# EAGLE design board02 (EAGLE 6.5.0)
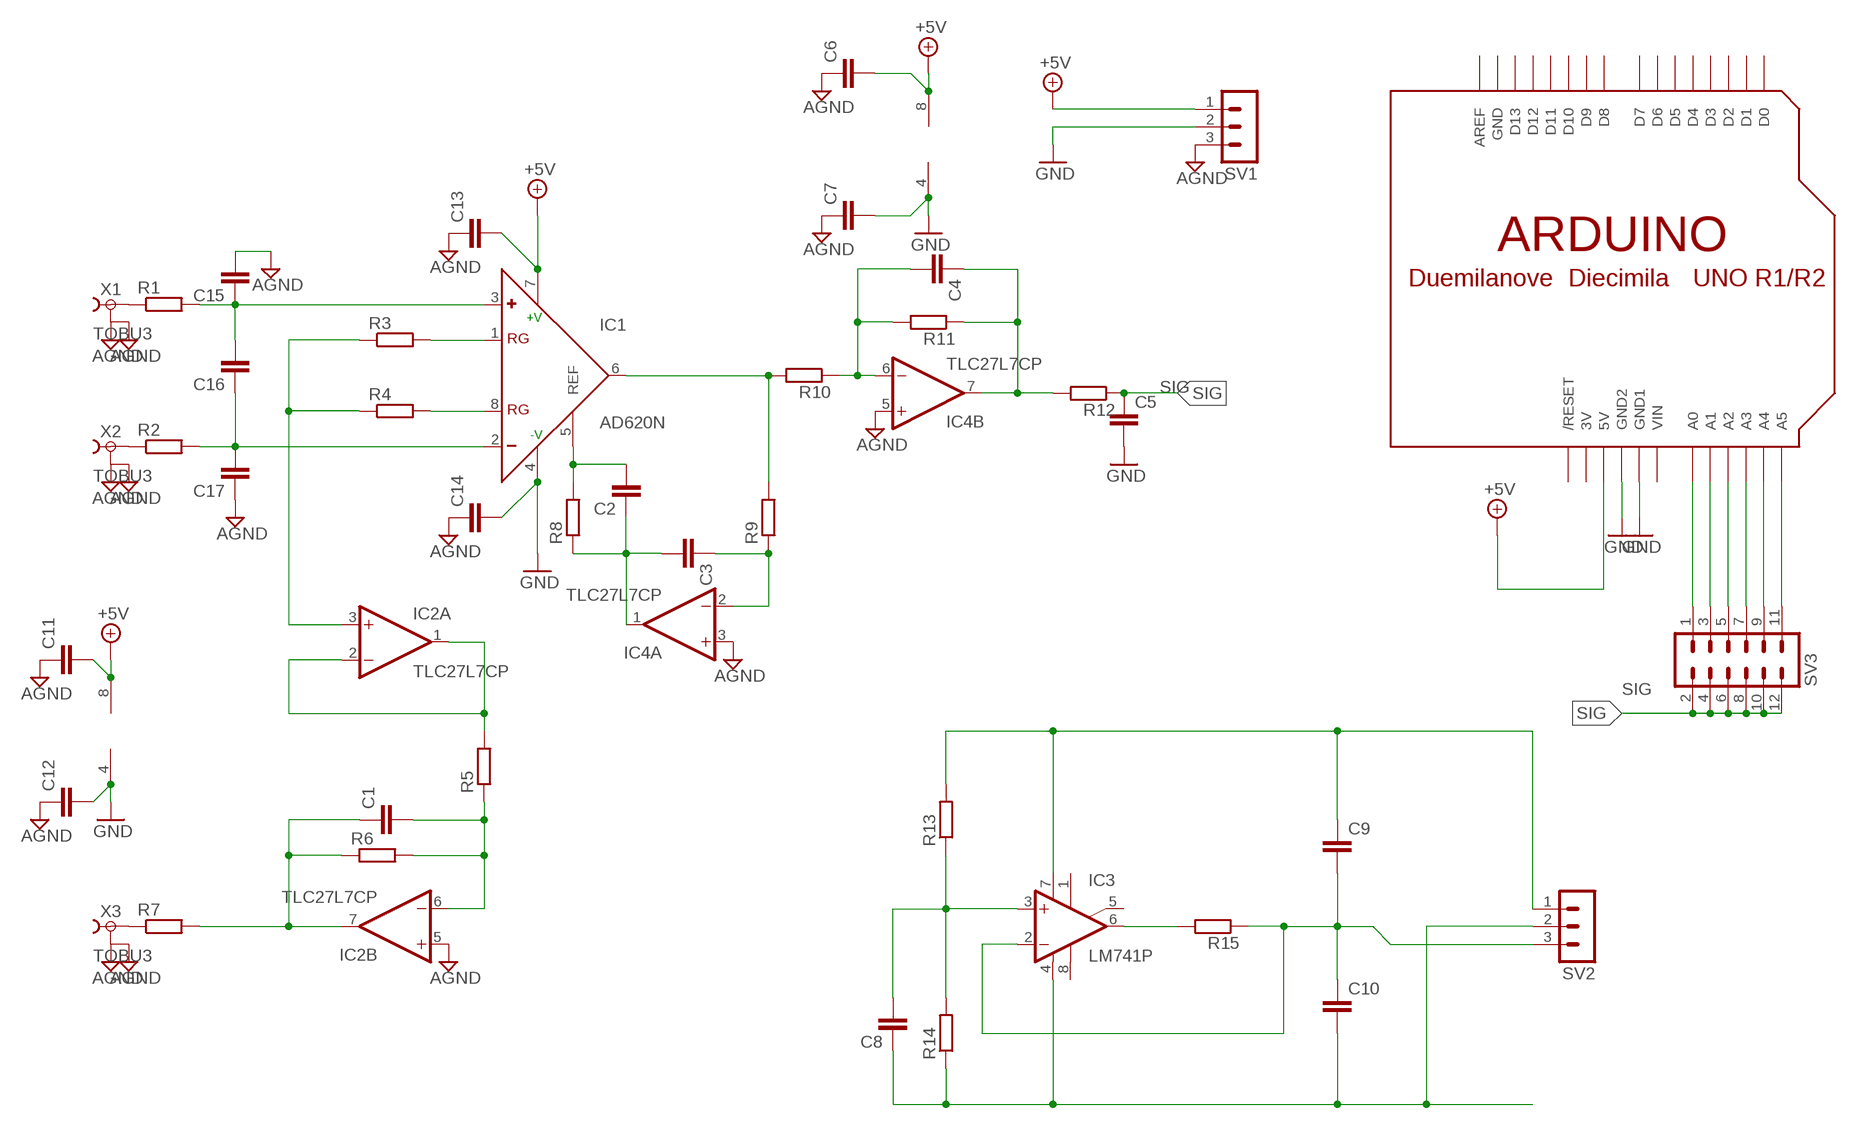
[diagram p0: schematic, sheet 1]

## Parts
C1  C-EU050-050X075  [C050-050X075]
C2  C-EU050-050X075  [C050-050X075]
C3  C-EU050-050X075  [C050-050X075]
C4  C-EU050-050X075  [C050-050X075]
C5  C-EU050-025X075  [C050-025X075]
C6  C-EU050-025X075  [C050-025X075]
C7  C-EU050-025X075  [C050-025X075]
C8  C-EU050-025X075  [C050-025X075]
C9  C-EU050-025X075  [C050-025X075]
C10  C-EU050-025X075  [C050-025X075]
C11  C-EU050-025X075  [C050-025X075]
C12  C-EU050-025X075  [C050-025X075]
C13  C-EU050-025X075  [C050-025X075]
C14  C-EU050-025X075  [C050-025X075]
C15  C-EU050-025X075  [C050-025X075]
C16  C-EU050-025X075  [C050-025X075]
C17  C-EU050-025X075  [C050-025X075]
IC1  AD620N  [DIL08]
IC2  TLC27L7CP  [DIL08]
IC3  LM741P  [DIL08]
IC4  TLC27L7CP  [DIL08]
R1  R-EU_0204/7  [0204/7]
R2  R-EU_0204/7  [0204/7]
R3  R-EU_0204/7  [0204/7]
R4  R-EU_0204/7  [0204/7]
R5  R-EU_0204/7  [0204/7]
R6  R-EU_0204/7  [0204/7]
R7  R-EU_0204/7  [0204/7]
R8  R-EU_0204/7  [0204/7]
R9  R-EU_0204/7  [0204/7]
R10  R-EU_0204/7  [0204/7]
R11  R-EU_0204/7  [0204/7]
R12  R-EU_0204/7  [0204/7]
R13  R-EU_0204/7  [0204/7]
R14  R-EU_0204/7  [0204/7]
R15  R-EU_0204/7  [0204/7]
SV1  MA03-1  [MA03-1]
SV2  MA03-1  [MA03-1]
SV3  MA06-2  [MA06-2]
U$2  ARDUINO-NC  [ARDUINO-NOCONN]
X1  TOBU3  [TOBU3]
X2  TOBU3  [TOBU3]
X3  TOBU3  [TOBU3]

## Nets
+5V: C6.2 C11.2 C13.2 IC1.7(+V) IC2.8(C:VDD) IC4.8(C:VDD) SV1.1 U$2.5V
AGND: C6.1 C7.1 C11.1 C12.1 C13.1 C14.1 C15.2 C17.1 IC2.5(B:+IN) IC4.3(A:+IN) IC4.5(B:+IN) SV1.3 X1.2 X1.2@1 X1.2@2 X2.2 X2.2@1 X2.2@2 X3.2 X3.2@1 X3.2@2
GND: C5.2 C7.2 C12.2 C14.2 IC1.4(-V) IC2.4(C:GND) IC4.4(C:GND) SV1.2 U$2.GND1 U$2.GND2
N$1: C15.1 C16.2 IC1.3(+) R1.2
N$2: C16.1 C17.2 IC1.2(-) R2.2
N$3: IC1.1(RG) R3.2
N$4: IC1.8(RG) R4.2
N$5: C1.1 IC2.7(B:OUT) R6.1 R7.2
N$6: IC2.3(A:+IN) R3.1 R4.1
N$7: IC2.1(A:OUT) IC2.2(A:-IN) R5.2
N$8: C1.2 IC2.6(B:-IN) R5.1 R6.2
N$9: C2.1 C3.2 IC4.1(A:OUT) R8.1
N$10: C2.2 IC1.5(REF) R8.2
N$11: IC1.6(OUT) R9.2 R10.2
N$12: C3.1 IC4.2(A:-IN) R9.1
N$13: C4.2 IC4.6(B:-IN) R10.1 R11.2
N$14: C4.1 IC4.7(B:OUT) R11.1 R12.2
N$16: R1.1 X1.1
N$17: R2.1 X2.1
N$18: R7.1 X3.1
N$19: C8.1 C10.2 IC3.4(V-) R14.1 SV2.2
N$20: C8.2 IC3.3(+IN) R13.1 R14.2
N$21: C9.1 IC3.7(V+) R13.2 SV2.1
N$22: IC3.6(OUT) R15.2
N$23: C9.2 C10.1 IC3.2(-IN) R15.1 SV2.3
N$24: SV3.1 U$2.A0
N$25: SV3.3 U$2.A1
N$26: SV3.5 U$2.A2
N$27: SV3.7 U$2.A3
N$28: SV3.9 U$2.A4
N$29: SV3.11 U$2.A5
SIG: C5.1 R12.1 SV3.2 SV3.4 SV3.6 SV3.8 SV3.10 SV3.12
Unconnected: IC3.1(ON1) IC3.5(ON2) IC3.8(OPT) U$2.AREF U$2.D0 U$2.D1 U$2.D2 U$2.D3 U$2.D4 U$2.D5 U$2.D6 U$2.D7 U$2.D8 U$2.D9 U$2.D10 U$2.D11 U$2.D12 U$2.D13 U$2.RESET(/RESET)

## Power pins joined to a net without a drawn wire
3V: U$2.3V
GND: U$2.GND
VIN: U$2.VIN

## Library data of the parts
C1-C17 = rcl:C-EU: CAPACITOR, European symbol
IC1 = analog-devices:AD620: Low Cost, Low Power, Instrumentation Amplifier Source: http://www.analog.com/UploadedFiles/Data_Sheets/37793330023930AD620_e.pdf; MF: ALTERA CORPORATION; MPN: AD620AN; OC_FARNELL: 1523782; OC_NEWARK: 05F7108
IC2 IC4 = linear:TLC27L*: LinCMOS(TM) PRECISION DUAL OPERATIONAL AMPLIFIERS Source: http://focus.ti.com/lit/ds/symlink/tlc27l2.pdf
IC3 = linear:*741: OP AMP
R1-R15 = rcl:R-EU_: RESISTOR, European symbol
SV1 SV2 = con-lstb:MA03-1: PIN HEADER; OC_FARNELL: unknown; OC_NEWARK: unknown
SV3 = con-lstb:MA06-2: PIN HEADER; OC_FARNELL: unknown; OC_NEWARK: unknown
U$2 = adafruit:ARDUINO: Arduino Diecimila/Duemilanove Make a shield with ease, this package has all the named pins as well as the two mounting drill holes and an outline of the USB and DC power connector. The outline is on the DIMENSION layer, so if your board house uses it they will cut the outline to match. http://www.ladyada.net/library/pcb/eaglelibrary.html
X1-X3 = con-hirschmann:TOBU3: Female Cinch CONNECTOR ( RCA Jack ); MF: FARNELL; MPN: TOBU 3; OC_FARNELL: 592791; OC_NEWARK: 06WX5914

## Board
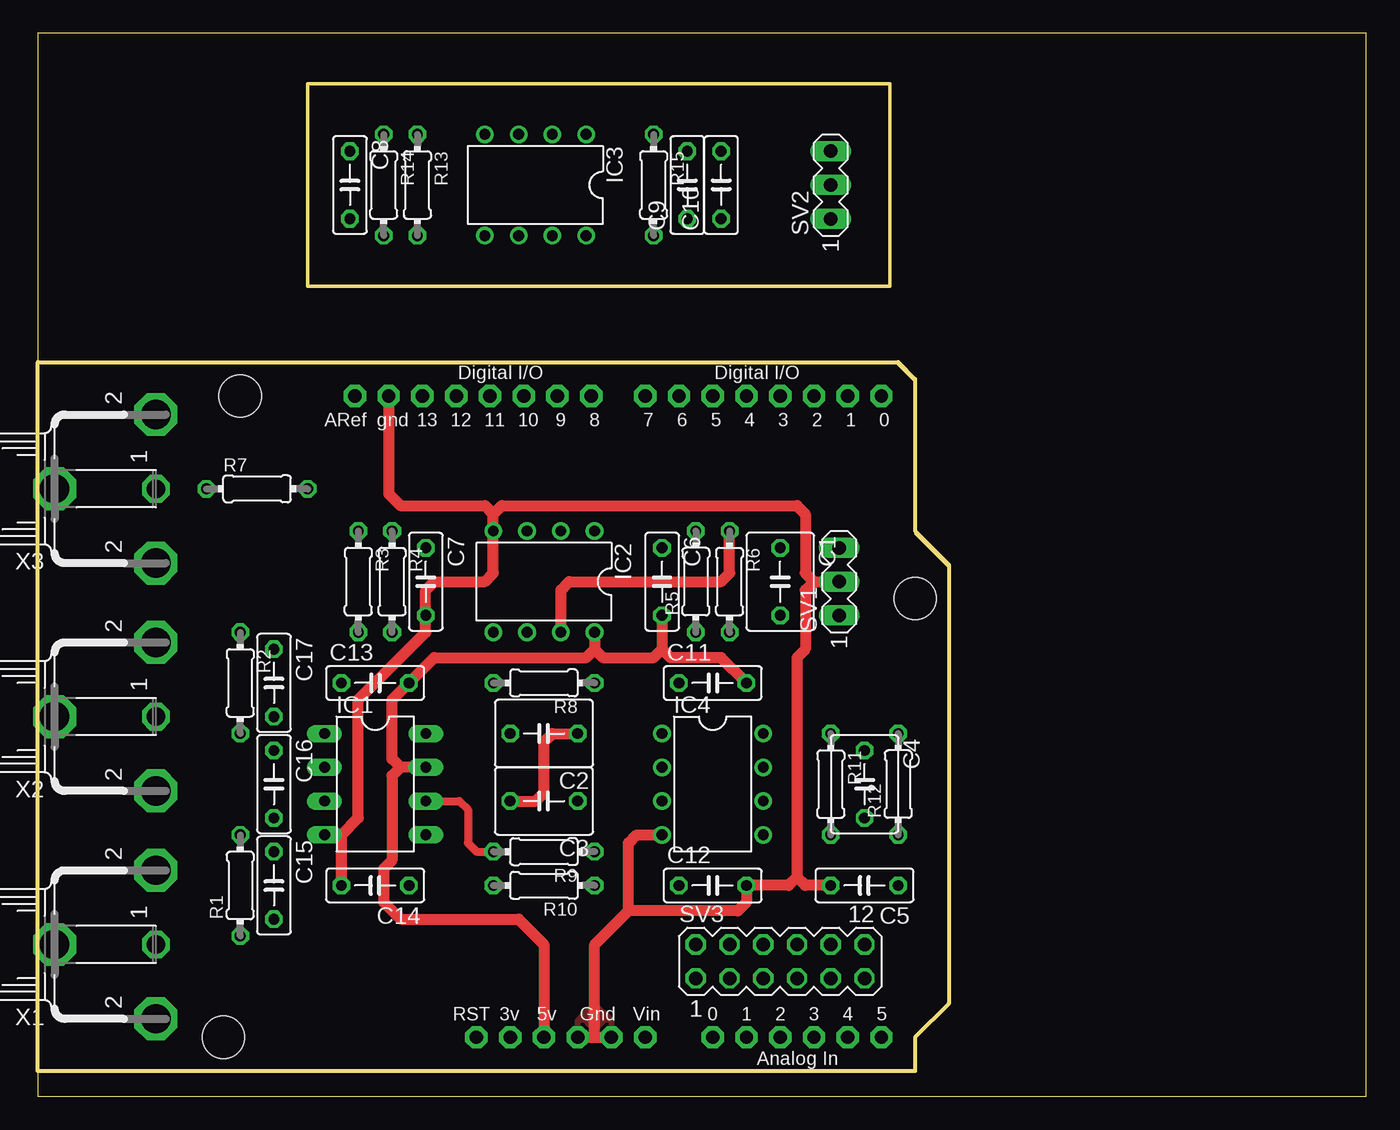
[diagram p1: board, top side]
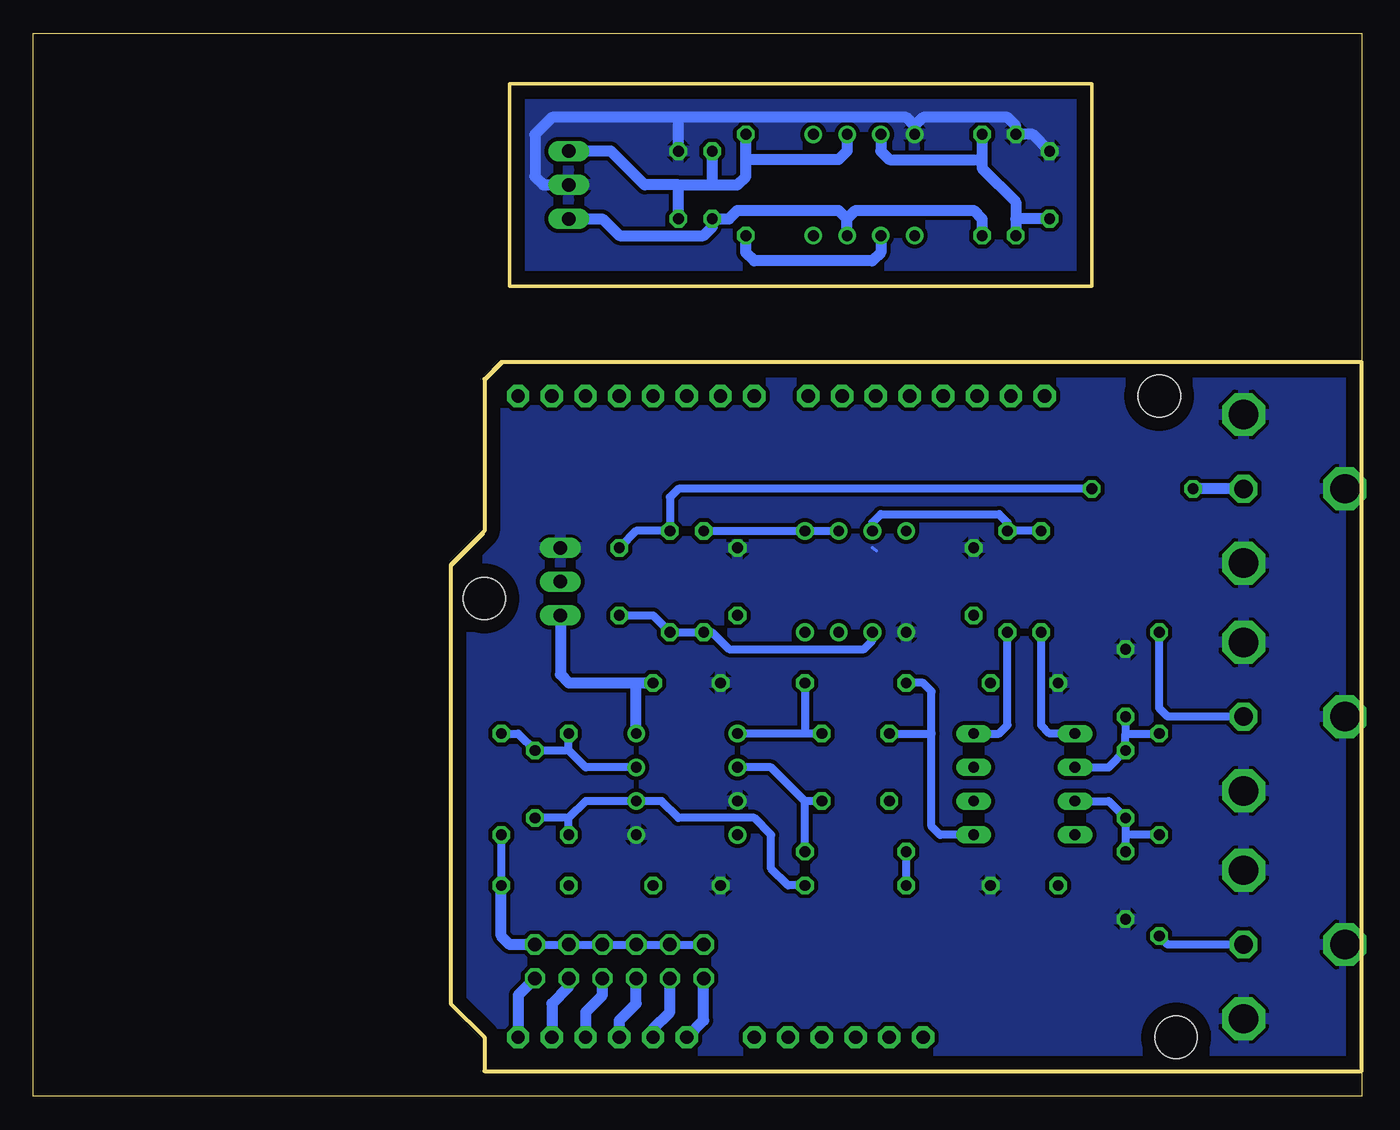
[diagram p2: board, bottom side, seen from below]

Size 100 x 80 mm. Coordinates in mm from the lower left corner, seen from the top.
Outline: 0,55.24 0,80 100,80 100,0 0,0 0,1.91
Outline: 0,55.24 64.77,55.24 66.04,53.98 66.04,42.55 68.58,40.01 68.58,6.99 66.04,4.45 66.04,1.91 0,1.91
Outline: 0,1.91 0,55.24
Outline: 64.14,76.2 64.14,60.96 20.32,60.96 20.32,76.2 64.14,76.2
Copper layers (1*16): Top 0.035mm / dielectric 1.5mm / Bottom 0.035mm
Design rules "default": minimum track width 10mil, minimum drill 24mil, track to track 8mil, track to pad 8mil, pad to pad 8mil, via to via 8mil, smd to smd 8mil, copper to edge 40mil, drill to drill 8mil, minimum pad ring 10mil, minimum via ring 8mil, stop-mask expansion 4mil, vias tented up to drill 0mil, thermal gap 10mil

### Footprints (pad centres in the part's own frame; a part is rotated, then mirrored left to right if it is on the bottom)
C050-050X075 = drill 0.813 octagon: 1 -2.54,0; 2 2.54,0
C050-025X075 = drill 0.813 octagon: 1 -2.54,0; 2 2.54,0
DIL08 = drill 0.813 long: 1 -3.81,-3.81; 2 -1.27,-3.81; 3 1.27,-3.81; 4 3.81,-3.81; 5 3.81,3.81; 6 1.27,3.81; 7 -1.27,3.81; 8 -3.81,3.81
DIL08' = drill 0.813 pad 1.27: 1 -3.81,-3.81; 2 -1.27,-3.81; 3 1.27,-3.81; 4 3.81,-3.81; 5 3.81,3.81; 6 1.27,3.81; 7 -1.27,3.81; 8 -3.81,3.81
0204/7 = drill 0.813 octagon: 1 -3.81,0; 2 3.81,0
MA03-1 = drill 1.016 long: 1 -2.54,0; 2 0,0; 3 2.54,0
MA06-2 = drill 1.016 octagon: 1 -6.35,-1.27; 2 -6.35,1.27; 3 -3.81,-1.27; 4 -3.81,1.27; 5 -1.27,-1.27; 6 -1.27,1.27; 7 1.27,-1.27; 8 1.27,1.27; 9 3.81,-1.27; 10 3.81,1.27; 11 6.35,-1.27; 12 6.35,1.27
ARDUINO-NOCONN = drill 1 pad 1.676 octagon: 3V 35.56,2.54; 5V 38.1,2.54; A0 50.8,2.54; A1 53.34,2.54; A2 55.88,2.54; A3 58.42,2.54; A4 60.96,2.54; A5 63.5,2.54; AREF 23.876,50.8; D0 63.5,50.8; D1 60.96,50.8; D2 58.42,50.8; D3 55.88,50.8; D4 53.34,50.8; D5 50.8,50.8; D6 48.26,50.8; D7 45.72,50.8; D8 41.656,50.8; D9 39.116,50.8; D10 36.576,50.8; D11 34.036,50.8; D12 31.496,50.8; D13 28.956,50.8; GND 26.416,50.8; GND1 43.18,2.54; GND2 40.64,2.54; RESET 33.02,2.54; VIN 45.72,2.54 | hole 3.2: 15.24,50.8; 66.04,35.56; 13.97,2.54
TOBU3 = drill 1.397 octagon: 1 0,-2.54 | drill 2.21 octagon: 2 5.588,-2.54; 2@1 -5.588,-2.54; 2@2 0,5.08

### Placement (x,y rotation side)
C1  55.88,38.73 270 top
C2  38.1,27.3 180 top
C3  38.1,22.23 180 top
C4  62.23,23.5 270 top
C5  62.23,15.88 180 top
C6  46.99,38.73 270 top
C7  29.21,38.73 270 top
C8  23.5,68.58 270 top
C9  48.9,68.58 90 top
C10  51.44,68.58 90 top
C11  50.8,31.11 0 top
C12  50.8,15.88 0 top
C13  25.4,31.11 0 top
C14  25.4,15.88 180 top
C15  17.78,15.88 270 top
C16  17.78,23.5 270 top
C17  17.78,31.11 270 top
IC1  25.4,23.5 270 top
IC2  TLC27L7CP  [DIL08']  38.1,38.73 180 top
IC3  LM741P  [DIL08']  37.47,68.58 180 top
IC4  TLC27L7CP  [DIL08']  50.8,23.5 270 top
R1  15.24,15.88 90 top
R2  15.24,31.11 270 top
R3  24.13,38.73 270 top
R4  26.67,38.73 270 top
R5  49.53,38.73 90 top
R6  52.07,38.73 270 top
R7  16.51,45.72 0 top
R8  38.1,31.11 180 top
R9  38.1,18.41 180 top
R10  38.1,15.88 180 top
R11  59.69,23.5 270 top
R12  64.77,23.5 90 top
R13  28.57,68.58 270 top
R14  26.04,68.58 270 top
R15  46.35,68.58 270 top
SV1  60.33,38.73 90 top
SV2  59.69,68.58 90 top
SV3  55.88,10.16 0 top
U$2  0,1.91 0 top
X1  6.35,11.43 90 top
X2  6.35,28.57 90 top
X3  6.35,45.72 90 top

### Tracks (layer width: path | path; a pad name or v marks a point on that pad's centre or on a via)
+5V
  Top 0.813: C11.2 51.44,33.02 47.62,33.02 46.99,33.66 | 41.91,33.66 41.27,33.02 29.84,33.02 C13.2 26.67,29.84 26.67,25.4 27.3,24.77 | IC2.8 41.91,33.66 | 41.91,33.66 42.55,33.02 46.35,33.02 46.99,33.66 | C6.2 46.99,33.66 | IC1.7 27.3,24.77 | 27.3,24.77 26.67,24.13 26.67,17.78 26.04,17.14 26.04,14.61 27.3,13.34 36.2,13.34 38.1,11.43 U$2.5V
  Bottom 0.813: SV1.1 60.33,31.75 59.69,31.11 54.61,31.11 | 54.61,31.11 C11.2 | IC4.8 54.61,31.11
AGND
  Bottom 0.254: 36.83,41.27 36.54,41.07 | X3.2 8.89,51.44 8.74,51.16 | IC4.3
  pour Bottom (isolate 0.305, rank 2): 0,55.24 64.14,55.24 66.04,53.34 66.04,42.55 69.22,39.37 68.58,6.99 66.04,4.45 66.04,1.91 0,1.91
GND
  Top 0.813: C14.2 22.86,19.68 | IC1.4 22.86,19.68 | 22.86,19.68 24.13,20.95 24.13,29.84 29.21,34.92 C7.2 29.21,38.1 29.84,38.73 33.66,38.73 34.29,39.37 IC2.4 34.29,43.81 | 58.42,38.73 57.78,38.1 57.78,33.66 57.15,33.02 57.15,16.51 | 34.29,43.81 34.92,44.45 57.15,44.45 57.78,43.81 57.78,39.37 58.42,38.73 | 58.42,38.73 SV1.2 | 41.91,4.45 41.91,11.43 44.45,13.97 | 44.45,13.97 44.45,19.05 45.09,19.68 IC4.4 | U$2.GND 26.42,45.34 27.3,44.45 33.66,44.45 34.29,43.81 | C5.2 57.78,15.88 57.15,16.51 | 57.15,16.51 56.52,15.88 C12.2 53.34,14.61 52.7,13.97 44.45,13.97 | U$2.GND2 U$2.GND1
  pour Top: 40.64,4.45 40.64,5.71 41.91,6.99 43.18,5.71 43.18,4.45
N$1
  Bottom 0.61: IC1.3 19.05,22.23 C16.2 17.78,19.68 | 17.78,19.68 C15.1 | R1.2 17.78,19.68
N$2
  Bottom 0.61: IC1.2 19.05,24.77 C16.1 17.78,27.3 | 17.78,27.3 R2.2 | C17.2 17.78,27.3
N$3
  Bottom 0.61: IC1.1 23.5,27.3 24.13,27.94 R3.2
N$4
  Bottom 0.61: IC1.8 27.3,27.3 26.67,27.94 R4.2
N$5
  Top 0.813: IC2.7 39.37,38.1 40.01,38.73 51.44,38.73 52.07,39.37 R6.1
  Bottom 0.61: C1.1 54.61,42.55 R6.1 52.07,45.09 51.44,45.72 R7.2
N$6
  Bottom 0.61: IC2.3 36.83,43.18 36.2,43.81 27.3,43.81 26.67,43.18 R4.1 R3.1
N$7
  Bottom 0.61: IC2.2 IC2.1 R5.2
N$8
  Bottom 0.61: C1.2 53.34,36.2 R6.2 R5.1 48.9,34.92 47.62,33.66 37.47,33.66 36.83,34.29 IC2.6
N$9
  Top 0.813: C3.2 37.47,22.23 38.1,22.86 38.1,26.67 38.73,27.3 C2.1
  Bottom 0.61: C2.1 41.91,27.3 | 41.91,27.3 IC4.1 | R8.1 41.91,27.3
N$10
  Bottom 0.61: IC1.5 31.75,19.68 32.38,20.32 32.38,27.3 | 32.38,27.3 32.38,30.48 33.02,31.11 R8.2 | C2.2 32.38,27.3
N$11
  Top 0.61: IC1.6 31.75,22.23 32.38,21.59 32.38,19.05 33.02,18.41 R9.2
  Bottom 0.61: R10.2 R9.2
N$12
  Bottom 0.61: R9.1 41.91,22.23 | 41.91,22.23 44.45,24.77 IC4.2 | C3.1 41.91,22.23
N$13
  Bottom 0.61: 59.69,20.95 58.42,22.23 IC4.6 52.7,22.23 51.44,20.95 45.72,20.95 44.45,19.68 44.45,17.14 43.18,15.88 R10.1 | 59.69,20.95 C4.2 | R11.2 59.69,20.95
N$14
  Bottom 0.61: IC4.7 58.42,24.77 59.69,26.04 | 59.69,26.04 R11.1 | 59.69,26.04 C4.1 63.5,27.3 R12.2
N$16
  Bottom 0.61: X1.1 14.61,11.43 R1.1
N$17
  Bottom 0.61: X2.1 14.61,28.57 15.24,29.21 R2.1
N$18
  Bottom 0.813: X3.1 R7.1
N$19
  Bottom 0.813: IC3.4 33.66,73.03 | 33.66,73.03 34.29,73.66 51.44,73.66 | 51.44,73.66 60.96,73.66 62.23,72.39 62.23,69.22 61.59,68.58 SV2.2 | C10.2 51.44,73.66 | C8.1 24.77,72.39 R14.1 26.04,73.03 26.67,73.66 33.02,73.66 33.66,73.03
  pour Bottom (isolate 0.305): 64.14,76.2 64.14,60.96 20.32,60.96 20.32,76.2
N$20
  Bottom 0.813: C8.2 26.04,66.04 | 26.04,66.04 R14.2 | R13.1 28.57,70.48 | IC3.3 36.2,71.12 35.56,70.48 28.57,70.48 | 28.57,70.48 28.57,69.85 26.04,67.31 26.04,66.04
N$21
  Bottom 0.813: 38.73,66.04 39.37,66.67 46.99,66.67 47.62,66.04 C9.1 48.9,65.41 49.53,64.77 55.88,64.77 57.15,66.04 SV2.1 | IC3.7 38.73,66.04 | 38.73,66.04 38.1,66.67 29.21,66.67 28.57,66.04 R13.2
N$22
  Bottom 0.813: IC3.6 36.2,63.5 36.83,62.87 45.72,62.87 46.35,63.5 R15.2
N$23
  Bottom 0.813: 51.44,68.58 48.9,68.58 | 48.9,68.58 46.99,68.58 46.35,69.22 46.35,70.48 | 46.35,70.48 R15.1 | IC3.2 38.73,71.12 39.37,70.48 46.35,70.48 | C10.1 51.44,68.58 | C9.2 48.9,68.58 | 51.44,68.58 53.98,68.58 56.52,71.12 SV2.3
N$24
  Bottom 0.813: SV3.1 49.53,5.71 U$2.A0
N$25
  Bottom 0.813: SV3.3 52.07,6.35 53.34,5.08 U$2.A1
N$26
  Bottom 0.813: SV3.5 54.61,6.99 55.88,5.71 U$2.A2
N$27
  Bottom 0.813: SV3.7 57.15,7.62 58.42,6.35 U$2.A3
N$28
  Bottom 0.813: SV3.9 59.69,8.26 60.96,6.99 U$2.A4
N$29
  Bottom 0.813: SV3.11 63.5,7.62 U$2.A5
SIG
  Bottom 0.61: R12.1 C5.1 | SV3.12 SV3.10 SV3.8 SV3.6 SV3.4 SV3.2
  Bottom 0.813: SV3.12 64.14,11.43 64.77,12.06 C5.1

### Text on the board
tDocu: V | - | + | VGND